# EAGLE schematic Battery_Board_v3.0 (EAGLE 9.6.2)
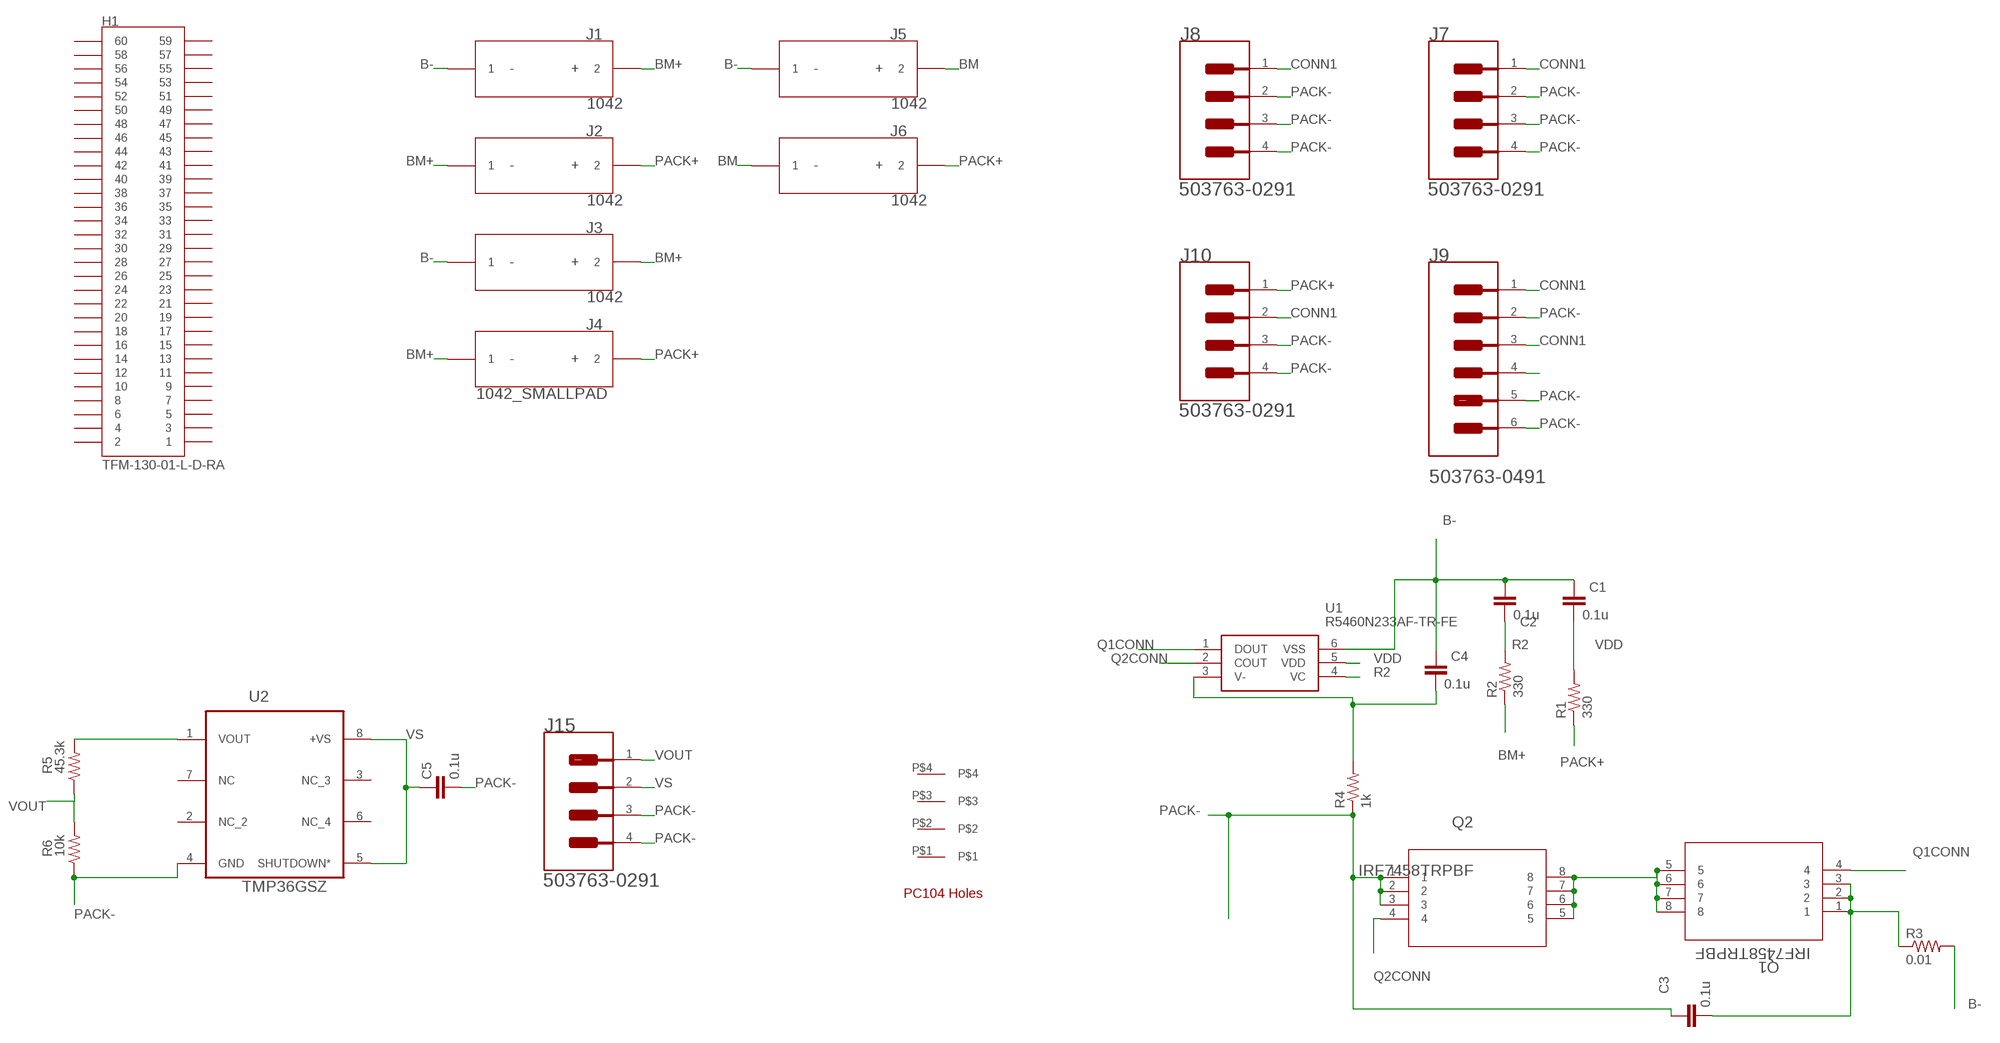
[diagram p0: schematic, sheet 1]

## Parts
C1  0.1u  CAP0603-CAP  [0603-CAP]
C2  0.1u  CAP0603-CAP  [0603-CAP]
C3  0.1u  CAP0603-CAP  [0603-CAP]
C4  0.1u  CAP0603-CAP  [0603-CAP]
C5  0.1u  CAP0805  [0805]
H1  TFM-130-01-L-D-RA  [60_PIN]
J1  1042  [1042_KEY]
J2  1042  [1042_KEY]
J3  1042  [1042_KEY]
J4  1042_SMALLPAD  [1042_KEY_SMALLPAD]
J5  1042  [1042_KEY]
J6  1042  [1042_KEY]
J7  MOLEX_503763-0291MOLEX_503763-0291_0_0  [MOLEX_503763-0291_0]
J8  MOLEX_503763-0291MOLEX_503763-0291_0_0  [MOLEX_503763-0291_0]
J9  MOLEX_503763-0491MOLEX_503763-0491_0_0  [MOLEX_503763-0491_0]
J10  MOLEX_503763-0291MOLEX_503763-0291_0_0  [MOLEX_503763-0291_0]
J15  MOLEX_503763-0291MOLEX_503763-0291_0_0  [MOLEX_503763-0291_0]
Q1  IRF7458TRPBF  [SO-8_IRF7458_3P9X4P9_INF]
Q2  IRF7458TRPBF  [SO-8_IRF7458_3P9X4P9_INF]
R1  330  RESISTOR0603-RES  [0603-RES]
R2  330  RESISTOR0603-RES  [0603-RES]
R3  0.01  RESISTOR2512  [R2512]
R4  1k  RESISTOR0603-RES  [0603-RES]
R5  45.3k  RESISTOR0805-RES  [0805]
R6  10k  RESISTOR0805-RES  [0805]
U1  R5460N233AF-TR-FE  [SOT95P280X140-6N]
U2  TMP36GSZ  [SOIC127P600X175-8N]
U$1  PC104_HOLES  [PC104_HOLES]

## Nets
B-: C1.1 C2.1 C4.1 J1.1 J3.1 J5.1 R3.2 U1.6(VSS)
BM: J5.2 J6.1
BM+: J1.2 J2.1 J3.2 J4.1 R2.1
CONN1: J7.1 J8.1 J9.1 J9.3 J10.2
N$1: R5.2 U2.1(VOUT)
N$2: C3.2 Q1.1 Q1.2 Q1.3 R3.1
N$4: C4.2 R4.2 U1.3(V-)
N$5: Q1.5 Q1.6 Q1.7 Q1.8 Q2.5 Q2.6 Q2.7 Q2.8
PACK+: J2.2 J4.2 J6.2 J10.1 R1.1
PACK-: C3.1 C5.2 J7.2 J7.3(MNT_1) J7.4(MNT_2) J8.2 J8.3(MNT_1) J8.4(MNT_2) J9.2 J9.4 J9.5(MNT_1) J9.6(MNT_2) J10.3(MNT_1) J10.4(MNT_2) J15.3(MNT_1) J15.4(MNT_2) Q2.1 Q2.2 Q2.3 R4.1 R6.1 U2.4(GND)
Q1CONN: Q1.4 U1.1(DOUT)
Q2CONN: Q2.4 U1.2(COUT)
R2: C2.2 R2.2 U1.4(VC)
VDD: C1.2 R1.2 U1.5(VDD)
VOUT: J15.1 R5.1 R6.2
VS: C5.1 J15.2 U2.5(SHUTDOWN*) U2.8(+VS)
Unconnected: H1.1 H1.2 H1.3 H1.4 H1.5 H1.6 H1.7 H1.8 H1.9 H1.10 H1.11 H1.12 H1.13 H1.14 H1.15 H1.16 H1.17 H1.18 H1.19 H1.20 H1.21 H1.22 H1.23 H1.24 H1.25 H1.26 H1.27 H1.28 H1.29 H1.30 H1.31 H1.32 H1.33 H1.34 H1.35 H1.36 H1.37 H1.38 H1.39 H1.40 H1.41 H1.42 H1.43 H1.44 H1.45 H1.46 H1.47 H1.48 H1.49 H1.50 H1.51 H1.52 H1.53 H1.54 H1.55 H1.56 H1.57 H1.58 H1.59 H1.60 U2.2(NC_2) U2.3(NC_3) U2.6(NC_4) U2.7(NC) U$1.P$1 U$1.P$2 U$1.P$3 U$1.P$4

## Library data of the parts
C1-C5 = HSFL_Main_Library (1):CAP: Capacitor Standard 0603 ceramic capacitor, and 0.1" leaded capacitor.
H1 = TFM-130-01-L-D-RA:TFM-130-01-L-D-RA
J1-J3 J5 J6 = Keystone_Electronics_1042:1042; COPYRIGHT: Copyright (C) 2021 Ultra Librarian. All rights reserved.; DIGI-KEY_PART_NUMBER_1: 1042L-ND; DIGI-KEY_PART_NUMBER_2: 2991-1042-ND; DIGI-KEY_PART_NUMBER_3: 36-1042-ND; DIGI-KEY_PART_NUMBER_4: KEY1066-ND; MANUFACTURER_PART_NUMBER: 1042; MFR_NAME: Keystone Electronics
J4 = Keystone_Electronics_1042:1042_SMALLPAD
J7 J8 J10 J15 = Molex - 503763-0291:MOLEX_503763-0291: 2 Positions Header Connector 0.039" (1.00mm) Surface Mount, Right Angle Gold; CENTROID_NOT_SPECIFIED: No; DATASHEET: http://www.molex.com/pdm_docs/sd/5037630291_sd.pdf; DIGIKEY_DESCRIPTION: CONN HEADER 1MM R/A 2CKT; DIGIKEY_PART_NUMBER: WM10654CT-ND; LEAD_FREE: yes; MF: Molex; MOUSER_PART_NUMBER: 538-503763-0291; MPN: 503763-0291; PACKAGE: HDR02; PREFIX: J; ROHS: yes; TEMPERATURE_RANGE_HIGH: +105°C; TEMPERATURE_RANGE_LOW: -40°C
J9 = Molex - 503763-0491:MOLEX_503763-0491: Wire-To-Board Connector, Pico-Lock 503763 Series, Surface Mount, Header, 4 Contacts, 1 mm; AUTOMOTIVE: No; CENTROID_NOT_SPECIFIED: No; CONN_GENDER: Male; CONN_ORIENTATION: Right Angle; CONTACT_MATERIAL: Gold,Nickel; CURRENT_RATING: 1.5A; DATASHEET: https://www.molex.com/webdocs/datasheets/pdf/en-us/5037630491_PCB_HEADERS.pdf; DEVICE_CLASS_L1: Connectors; DEVICE_CLASS_L2: Headers and Wire Housings; DEVICE_CLASS_L3: unset; DIGIKEY_DESCRIPTION: CONN HEADER 1MM R/A 4CKT; DIGIKEY_PART_NUMBER: WM10655CT-ND; FOOTPRINT_URL: https://www.molex.com/pdm_docs/sd/5037630491_sd.pdf; FOOTPRINT_VARIANT_NAME_0: Recommended_Land_Pattern; HEIGHT: 1.7mm; LEAD_FREE: Yes; MF: Molex; MFG_PACKAGE_IDENT: 503763-0491; MFG_PACKAGE_IDENT_DATE: 0; MFG_PACKAGE_IDENT_REV: 0; MOUSER_PART_NUMBER: 538-503763-0491; MPN: 503763-0491; NUMBER_OF_CONTACTS: 4; NUMBER_OF_ROWS: 1; PACKAGE: HDR4; PITCH: 1mm; PREFIX: J; ROHS: Yes; TEMPERATURE_RANGE_HIGH: +105°C; TEMPERATURE_RANGE_LOW: -40°C; VERIFICATION_VERSION: 0.0.0.1; VOLTAGE_RATING: 150V
Q1 Q2 = IRF7458:IRF7458TRPBF; COPYRIGHT: Copyright (C) 2021 Ultra Librarian. All rights reserved.; MANUFACTURER_PART_NUMBER: IRF7458TRPBF; MFR_NAME: Infineon
R1-R6 = HSFL_Main_Library (1):RESISTOR: Resistor Basic schematic elements and footprints for 0603, 1206, and PTH resistors.
U1 = SamacSys_Parts:R5460N233AF-TR-FE: Battery Management 2-Cell Li-ion Protection IC Source: Datasheet; DESCRIPTION: Battery Management 2-Cell Li-ion Protection IC; HEIGHT: 1.4mm; MANUFACTURER_NAME: Ricoh; MANUFACTURER_PART_NUMBER: R5460N233AF-TR-FE; MOUSER_PART_NUMBER: 848-R5460N233AFTRFE; MOUSER_PRICE-STOCK: https://www.mouser.co.uk/ProductDetail/Ricoh-Electronic-Devices-Company/R5460N233AF-TR-FE?qs=0lQeLiL1qyZJIzN8jBJcMQ%3D%3D
U2 = TMP36GSZ:TMP36GSZ: Voltage Output Temperature Sensors Check prices <https://pricing.snapeda.com/parts/TMP36GSZ/Analog%20Devices/view-part?ref=eda>; AVAILABILITY: In Stock; DESCRIPTION: Temperature Sensor Analog, Local -40°C ~ 125°C 10mV/°C 8-SOIC; MF: Analog Devices; MP: TMP36GSZ; PACKAGE: SOIC-8 Analog Devices; PRICE: None; PURCHASE-URL: https://pricing.snapeda.com/search/part/TMP36GSZ/?ref=eda
U$1 = PC104_holes:PC104_HOLES